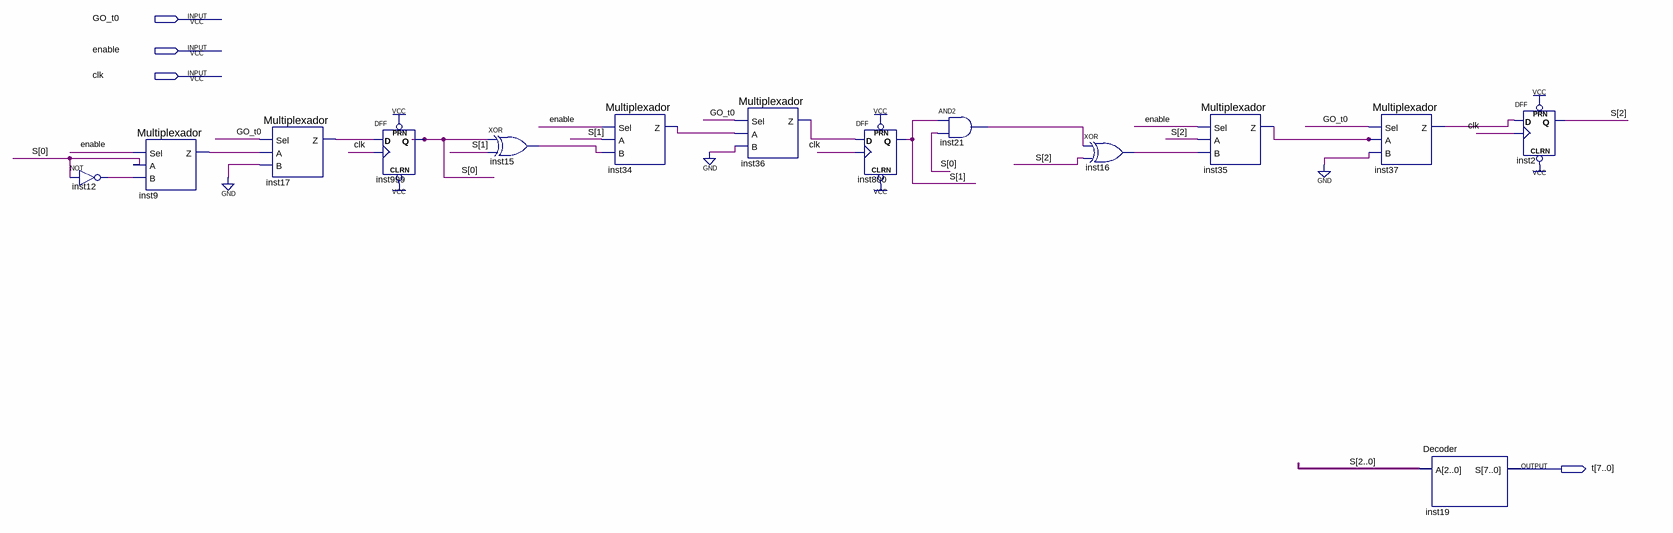
[diagram p0: schematic sheet]
// Quartus schematic TIMER.bdf as structural Verilog: 14 symbols, 4 pins
module TIMER (
  input  GO_t0,
  input  enable,
  input  clk,
  output [7:0] t
);

  wire inst9_z, inst12_out, inst15_out, inst16_out, inst17_z, inst21_out, inst34_z, inst35_z, inst36_z,
       inst37_z;
  wire [2:0] S;

  not inst12 (inst12_out, S[0]);
  Multiplexador inst9 (.Sel(enable), .A(S[0]), .B(inst12_out), .Z(inst9_z));
  Multiplexador inst17 (.Sel(GO_t0), .A(inst9_z), .B(1'b0), .Z(inst17_z));
  DFF inst999 (.CLRN(1'b1), .CLK(clk), .D(inst17_z), .PRN(1'b1), .Q(S[0]));
  xor inst15 (inst15_out, S[0], S[1]);
  Multiplexador inst34 (.Sel(enable), .A(S[1]), .B(inst15_out), .Z(inst34_z));
  Multiplexador inst36 (.Sel(GO_t0), .A(inst34_z), .B(1'b0), .Z(inst36_z));
  DFF inst800 (.CLRN(1'b1), .CLK(clk), .D(inst36_z), .PRN(1'b1), .Q(S[1]));
  and inst21 (inst21_out, S[1], S[0]);
  xor inst16 (inst16_out, inst21_out, S[2]);
  Multiplexador inst35 (.Sel(enable), .A(S[2]), .B(inst16_out), .Z(inst35_z));
  Multiplexador inst37 (.Sel(GO_t0), .A(inst35_z), .B(1'b0), .Z(inst37_z));
  Decoder inst19 (.A(S), .S(t));
  DFF inst2 (.CLRN(1'b1), .CLK(clk), .D(inst37_z), .PRN(1'b1), .Q(S[2]));
endmodule
